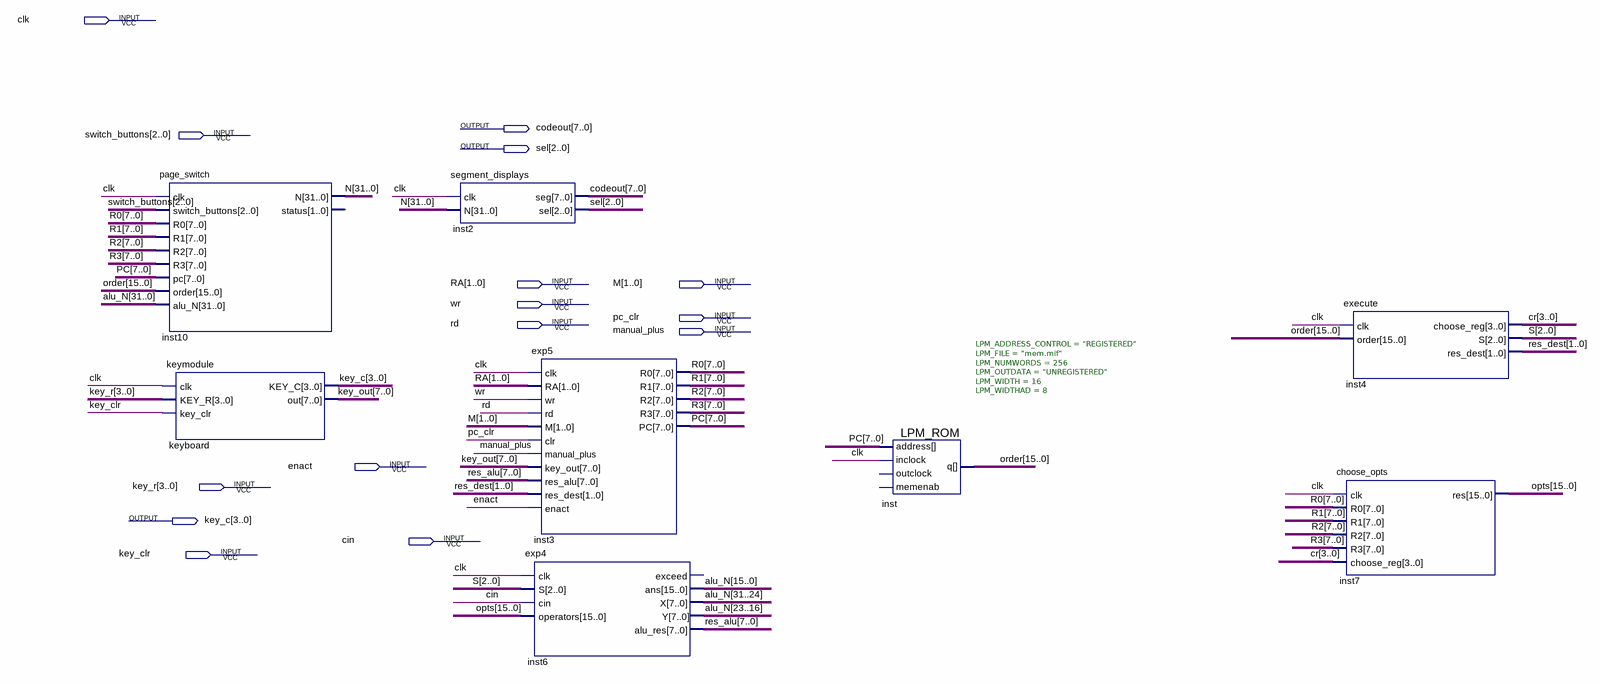
[diagram p0: schematic sheet]
// Quartus schematic exp8.bdf as structural Verilog: 8 symbols, 15 pins
module exp8 (
  input  clk,
  input  [2:0] switch_buttons,
  input  [1:0] RA,
  input  [1:0] M,
  input  wr,
  input  pc_clr,
  input  rd,
  input  manual_plus,
  input  enact,
  input  [3:0] key_r,
  input  cin,
  input  key_clr,
  output [7:0] codeout,
  output [2:0] sel,
  output [3:0] key_c
);

  wire [1:0] res_dest;
  wire [2:0] S;
  wire [3:0] cr;
  wire [7:0] key_out, PC, R0, R1, R2, R3, res_alu;
  wire [15:0] opts, order;
  wire [31:0] alu_N, N;

  page_switch inst10 (
    .clk(clk), .switch_buttons(switch_buttons), .R0(R0), .R1(R1), .R2(R2), .R3(R3), .pc(PC), .order(order),
    .alu_N(alu_N), .N(N));  // open: status
  keymodule keyboard (.clk(clk), .KEY_R(key_r), .key_clr(key_clr), .KEY_C(key_c), .out(key_out));
  segment_displays inst2 (.clk(clk), .N(N), .seg(codeout), .sel(sel));
  exp5 inst3 (
    .clk(clk), .RA(RA), .wr(wr), .rd(rd), .M(M), .clr(pc_clr), .manual_plus(manual_plus), .key_out(key_out),
    .res_alu(res_alu), .res_dest(res_dest), .enact(enact), .R0(R0), .R1(R1), .R2(R2), .R3(R3), .PC(PC));
  exp4 inst6 (
    .clk(clk), .S(S), .cin(cin), .operators(opts), .ans(alu_N[15:0]), .X(alu_N[31:24]), .Y(alu_N[23:16]),
    .alu_res(res_alu));  // open: exceed
  LPM_ROM #(.LPM_ADDRESS_CONTROL("REGISTERED"), .LPM_FILE("mem.mif"), .LPM_NUMWORDS(256), .LPM_OUTDATA("UNREGISTERED"), .LPM_WIDTH(16), .LPM_WIDTHAD(8)) inst (
    .address(PC), .inclock(clk), .q(order));  // open: outclock, memenab
  execute inst4 (.clk(clk), .order(order), .choose_reg(cr), .S(S), .res_dest(res_dest));
  choose_opts inst7 (.clk(clk), .R0(R0), .R1(R1), .R2(R2), .R3(R3), .choose_reg(cr), .res(opts));
endmodule
